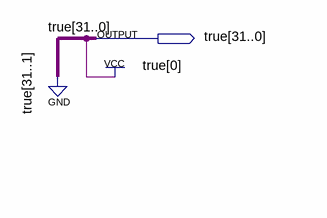
[diagram p0: schematic sheet]
// Quartus schematic true32.bdf as structural Verilog: 0 symbols, 1 pins
module true32 (
  output [31:0] true
);


  assign true = 32'b00000000000000000000000000000001;
endmodule
